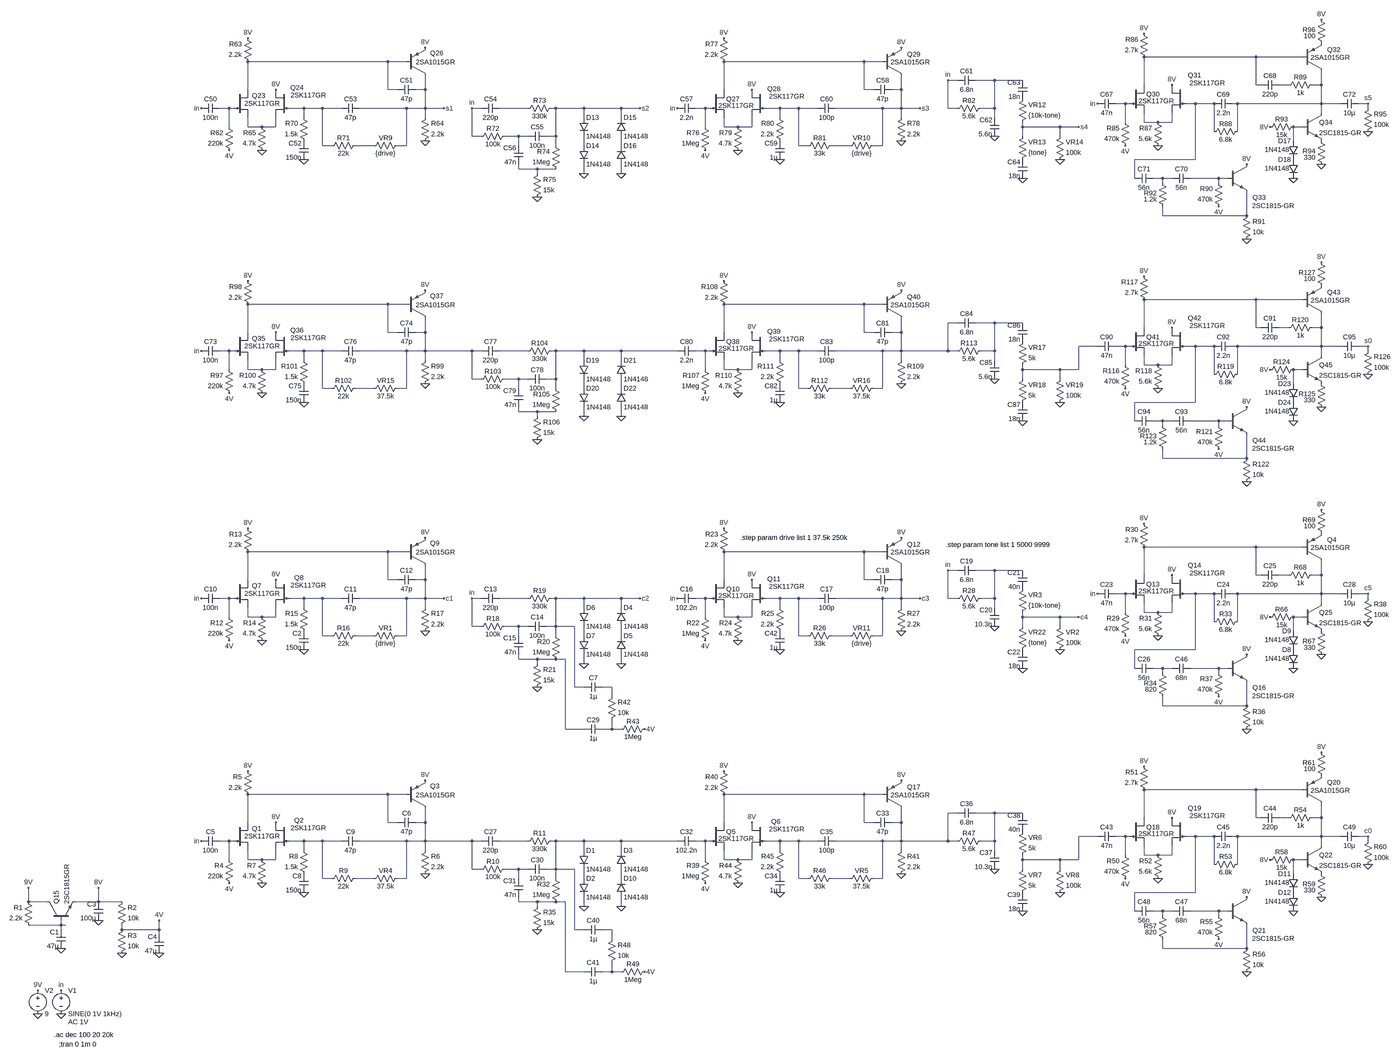
[diagram p0: schematic bd2w.asc, whole sheet]
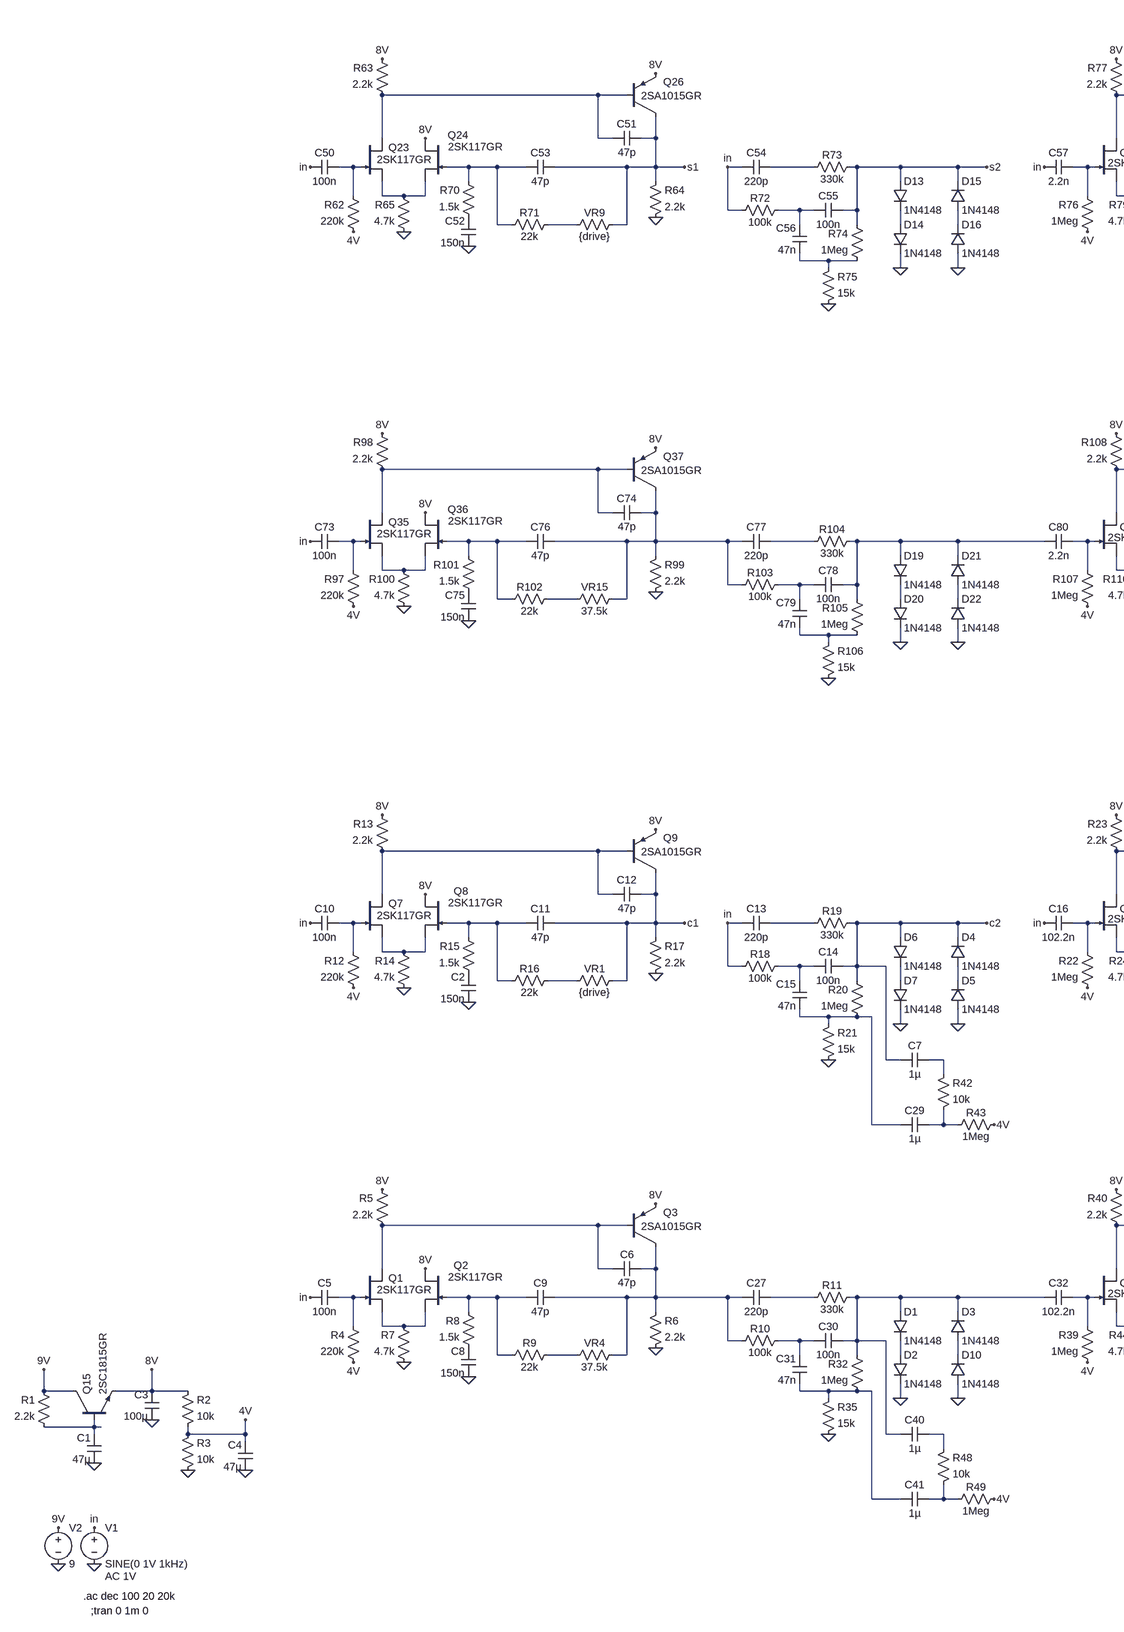
[diagram p1: schematic bd2w.asc, part, row 1 of 1, column 1 of 2]
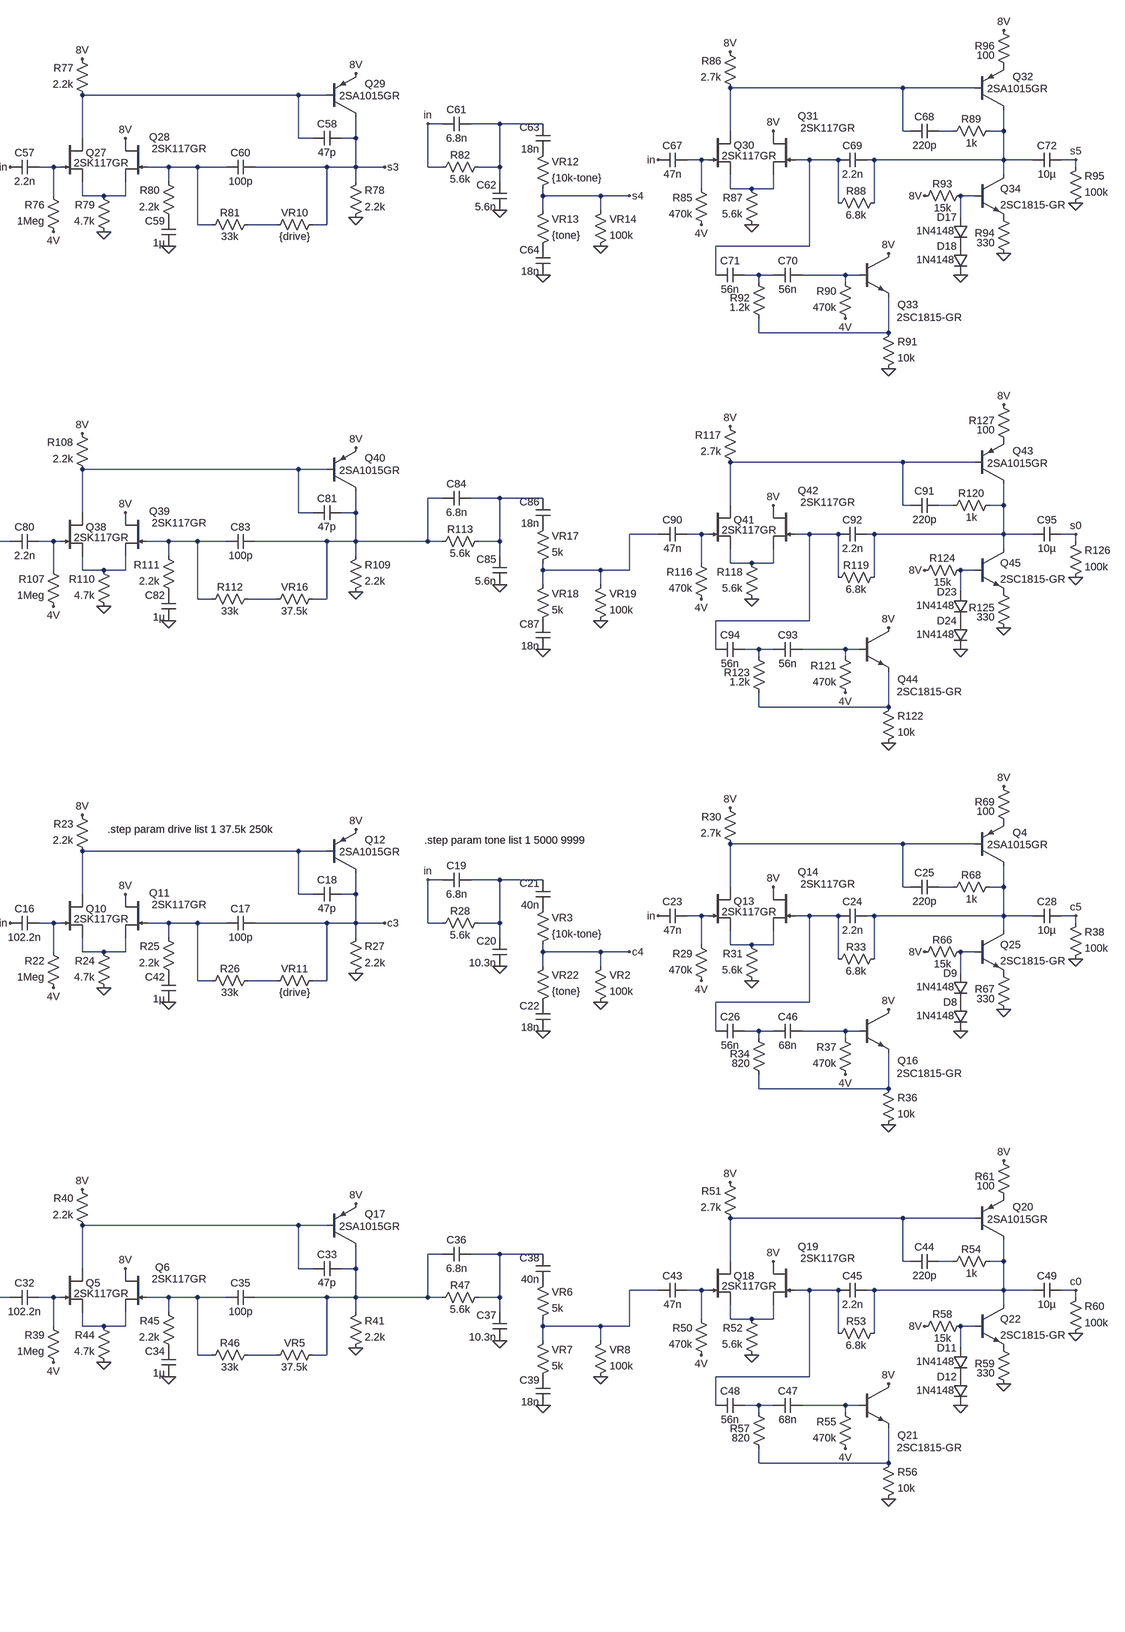
[diagram p2: schematic bd2w.asc, part, row 1 of 1, column 2 of 2]
* bd2w.asc
R12 4V N065 220k
C10 N065 in 100n
V1 in 0 SINE(0 1V 1kHz) AC 1V
R13 N058 8V 2.2k
R17 0 c1 2.2k
J§Q7 N058 N065 N071 2SK117GR
J§Q8 8V N066 N071 2SK117GR
Q9 c1 N058 8V 0 2SA1015GR
C12 c1 N058 47p
C2 0 P001 150n
R14 0 N071 4.7k
C11 c1 N066 47p
R15 P001 N066 1.5k
R16 N075 N066 22k
R§VR1 c1 N075 {drive}
C13 N067 in 220p
R18 N074 in 100k
R19 c2 N067 330k
C14 c2 N074 100n
R20 N079 c2 1Meg
C15 N079 N074 47n
R21 0 N079 15k
D6 c2 N076 1N4148
D7 N076 0 1N4148
D4 N077 c2 1N4148
D5 0 N077 1N4148
R22 4V N068 1Meg
C16 N068 in 102.2n
R23 N059 8V 2.2k
R27 0 c3 2.2k
J§Q10 N059 N068 N072 2SK117GR
J§Q11 8V N069 N072 2SK117GR
Q12 c3 N059 8V 0 2SA1015GR
C18 c3 N059 47p
C42 0 P002 1µ
R24 0 N072 4.7k
C17 c3 N069 100p
R25 P002 N069 2.2k
R26 N078 N069 33k
R§VR11 c3 N078 {drive}
R28 N060 in 5.6k
C19 N060 in 6.8n
C20 0 N060 10.3n
C21 P003 N060 40n
R§VR3 c4 P003 {10k-tone}
R§VR22 P004 c4 {tone}
C22 0 P004 18n
R§VR2 0 c4 100k
Q15 9V N114 8V 0 2SC1815GR
R1 N114 9V 2.2k
C1 0 N114 47µ
C3 0 8V 100µ
R2 4V 8V 10k
R3 0 4V 10k
C4 0 4V 47µ
V2 9V 0 9
C7 N082 c2 1µ
R42 N084 N082 10k
C29 N084 N079 1µ
R43 4V N084 1Meg
R29 4V N063 470k
C23 N063 in 47n
R30 N057 8V 2.7k
J§Q13 N057 N063 N070 2SK117GR
J§Q14 8V N064 N070 2SK117GR
Q4 N062 N057 P005 0 2SA1015GR
C25 N061 N057 220p
R31 0 N070 5.6k
C24 N062 N064 2.2n
R33 N062 N064 6.8k
R68 N062 N061 1k
C46 N080 N081 68n
Q16 8V N081 N083 0 2SC1815-GR
R37 4V N081 470k
R36 0 N083 10k
C26 N064 N080 56n
R34 N083 N080 820
Q25 N062 N073 P006 0 2SC1815-GR
R66 N073 8V 15k
D9 N073 P007 1N4148
D8 P007 0 1N4148
R67 0 P006 330
C28 c5 N062 10µ
R38 0 c5 100k
R69 P005 8V 100
R4 4V N096 220k
C5 N096 in 100n
R5 N086 8V 2.2k
R6 0 N092 2.2k
J§Q1 N086 N096 N103 2SK117GR
J§Q2 8V N097 N103 2SK117GR
Q3 N092 N086 8V 0 2SA1015GR
C6 N092 N086 47p
C8 0 P008 150n
R7 0 N103 4.7k
C9 N092 N097 47p
R8 P008 N097 1.5k
R9 N107 N097 22k
R§VR4 N092 N107 37.5k
C27 N098 N092 220p
R10 N106 N092 100k
R11 N099 N098 330k
C30 N099 N106 100n
R32 N111 N099 1Meg
C31 N111 N106 47n
R35 0 N111 15k
D1 N099 N108 1N4148
D2 N108 0 1N4148
D3 N109 N099 1N4148
D10 0 N109 1N4148
R39 4V N100 1Meg
C32 N100 N099 102.2n
R40 N087 8V 2.2k
R41 0 N088 2.2k
J§Q5 N087 N100 N104 2SK117GR
J§Q6 8V N101 N104 2SK117GR
Q17 N088 N087 8V 0 2SA1015GR
C33 N088 N087 47p
C34 0 P009 1µ
R44 0 N104 4.7k
C35 N088 N101 100p
R45 P009 N101 2.2k
R46 N110 N101 33k
R§VR5 N088 N110 37.5k
R47 N089 N088 5.6k
C36 N089 N088 6.8n
C37 0 N089 10.3n
C38 P010 N089 40n
R§VR6 N093 P010 5k
R§VR7 P011 N093 5k
C39 0 P011 18n
R§VR8 0 N093 100k
C40 N115 N099 1µ
R48 N117 N115 10k
C41 N117 N111 1µ
R49 4V N117 1Meg
R50 4V N094 470k
C43 N094 N093 47n
R51 N085 8V 2.7k
J§Q18 N085 N094 N102 2SK117GR
J§Q19 8V N095 N102 2SK117GR
Q20 N091 N085 P012 0 2SA1015GR
C44 N090 N085 220p
R52 0 N102 5.6k
C45 N091 N095 2.2n
R53 N091 N095 6.8k
R54 N091 N090 1k
C47 N112 N113 68n
Q21 8V N113 N116 0 2SC1815-GR
R55 4V N113 470k
R56 0 N116 10k
C48 N095 N112 56n
R57 N116 N112 820
Q22 N091 N105 P013 0 2SC1815-GR
R58 N105 8V 15k
D11 N105 P014 1N4148
D12 P014 0 1N4148
R59 0 P013 330
C49 c0 N091 10µ
R60 0 c0 100k
R61 P012 8V 100
R62 4V N009 220k
C50 N009 in 100n
R63 N002 8V 2.2k
R64 0 s1 2.2k
J§Q23 N002 N009 N015 2SK117GR
J§Q24 8V N010 N015 2SK117GR
Q26 s1 N002 8V 0 2SA1015GR
C51 s1 N002 47p
C52 0 P015 150n
R65 0 N015 4.7k
C53 s1 N010 47p
R70 P015 N010 1.5k
R71 N019 N010 22k
R§VR9 s1 N019 {drive}
C54 N011 in 220p
R72 N018 in 100k
R73 s2 N011 330k
C55 s2 N018 100n
R74 N023 s2 1Meg
C56 N023 N018 47n
R75 0 N023 15k
D13 s2 N020 1N4148
D14 N020 0 1N4148
D15 N021 s2 1N4148
D16 0 N021 1N4148
R76 4V N012 1Meg
C57 N012 in 2.2n
R77 N003 8V 2.2k
R78 0 s3 2.2k
J§Q27 N003 N012 N016 2SK117GR
J§Q28 8V N013 N016 2SK117GR
Q29 s3 N003 8V 0 2SA1015GR
C58 s3 N003 47p
C59 0 P016 1µ
R79 0 N016 4.7k
C60 s3 N013 100p
R80 P016 N013 2.2k
R81 N022 N013 33k
R§VR10 s3 N022 {drive}
R82 N004 in 5.6k
C61 N004 in 6.8n
C62 0 N004 5.6n
C63 P017 N004 18n
R§VR12 s4 P017 {10k-tone}
R§VR13 P018 s4 {tone}
C64 0 P018 18n
R§VR14 0 s4 100k
R85 4V N007 470k
C67 N007 in 47n
R86 N001 8V 2.7k
J§Q30 N001 N007 N014 2SK117GR
J§Q31 8V N008 N014 2SK117GR
Q32 N006 N001 P019 0 2SA1015GR
C68 N005 N001 220p
R87 0 N014 5.6k
C69 N006 N008 2.2n
R88 N006 N008 6.8k
R89 N006 N005 1k
C70 N024 N025 56n
Q33 8V N025 N026 0 2SC1815-GR
R90 4V N025 470k
R91 0 N026 10k
C71 N008 N024 56n
R92 N026 N024 1.2k
Q34 N006 N017 P020 0 2SC1815-GR
R93 N017 8V 15k
D17 N017 P021 1N4148
D18 P021 0 1N4148
R94 0 P020 330
C72 s5 N006 10µ
R95 0 s5 100k
R96 P019 8V 100
R97 4V N038 220k
C73 N038 in 100n
R98 N028 8V 2.2k
R99 0 N034 2.2k
J§Q35 N028 N038 N045 2SK117GR
J§Q36 8V N039 N045 2SK117GR
Q37 N034 N028 8V 0 2SA1015GR
C74 N034 N028 47p
C75 0 P022 150n
R100 0 N045 4.7k
C76 N034 N039 47p
R101 P022 N039 1.5k
R102 N049 N039 22k
R§VR15 N034 N049 37.5k
C77 N040 N034 220p
R103 N048 N034 100k
R104 N041 N040 330k
C78 N041 N048 100n
R105 N053 N041 1Meg
C79 N053 N048 47n
R106 0 N053 15k
D19 N041 N050 1N4148
D20 N050 0 1N4148
D21 N051 N041 1N4148
D22 0 N051 1N4148
R107 4V N042 1Meg
C80 N042 N041 2.2n
R108 N029 8V 2.2k
R109 0 N030 2.2k
J§Q38 N029 N042 N046 2SK117GR
J§Q39 8V N043 N046 2SK117GR
Q40 N030 N029 8V 0 2SA1015GR
C81 N030 N029 47p
C82 0 P023 1µ
R110 0 N046 4.7k
C83 N030 N043 100p
R111 P023 N043 2.2k
R112 N052 N043 33k
R§VR16 N030 N052 37.5k
R113 N031 N030 5.6k
C84 N031 N030 6.8n
C85 0 N031 5.6n
C86 P024 N031 18n
R§VR17 N035 P024 5k
R§VR18 P025 N035 5k
C87 0 P025 18n
R§VR19 0 N035 100k
R116 4V N036 470k
C90 N036 N035 47n
R117 N027 8V 2.7k
J§Q41 N027 N036 N044 2SK117GR
J§Q42 8V N037 N044 2SK117GR
Q43 N033 N027 P026 0 2SA1015GR
C91 N032 N027 220p
R118 0 N044 5.6k
C92 N033 N037 2.2n
R119 N033 N037 6.8k
R120 N033 N032 1k
C93 N054 N055 56n
Q44 8V N055 N056 0 2SC1815-GR
R121 4V N055 470k
R122 0 N056 10k
C94 N037 N054 56n
R123 N056 N054 1.2k
Q45 N033 N047 P027 0 2SC1815-GR
R124 N047 8V 15k
D23 N047 P028 1N4148
D24 P028 0 1N4148
R125 0 P027 330
C95 s0 N033 10µ
R126 0 s0 100k
R127 P026 8V 100
.model D D
.lib standard.dio
.model NPN NPN
.model PNP PNP
.lib standard.bjt
.model NJF NJF
.model PJF PJF
.lib standard.jft
.ac dec 100 20 20k
;tran 0 1m 0
.step param drive list 1 37.5k 250k
.step param tone list 1 5000 9999
.backanno
.end